# EAGLE design merch-hat (EAGLE 8.0.1)
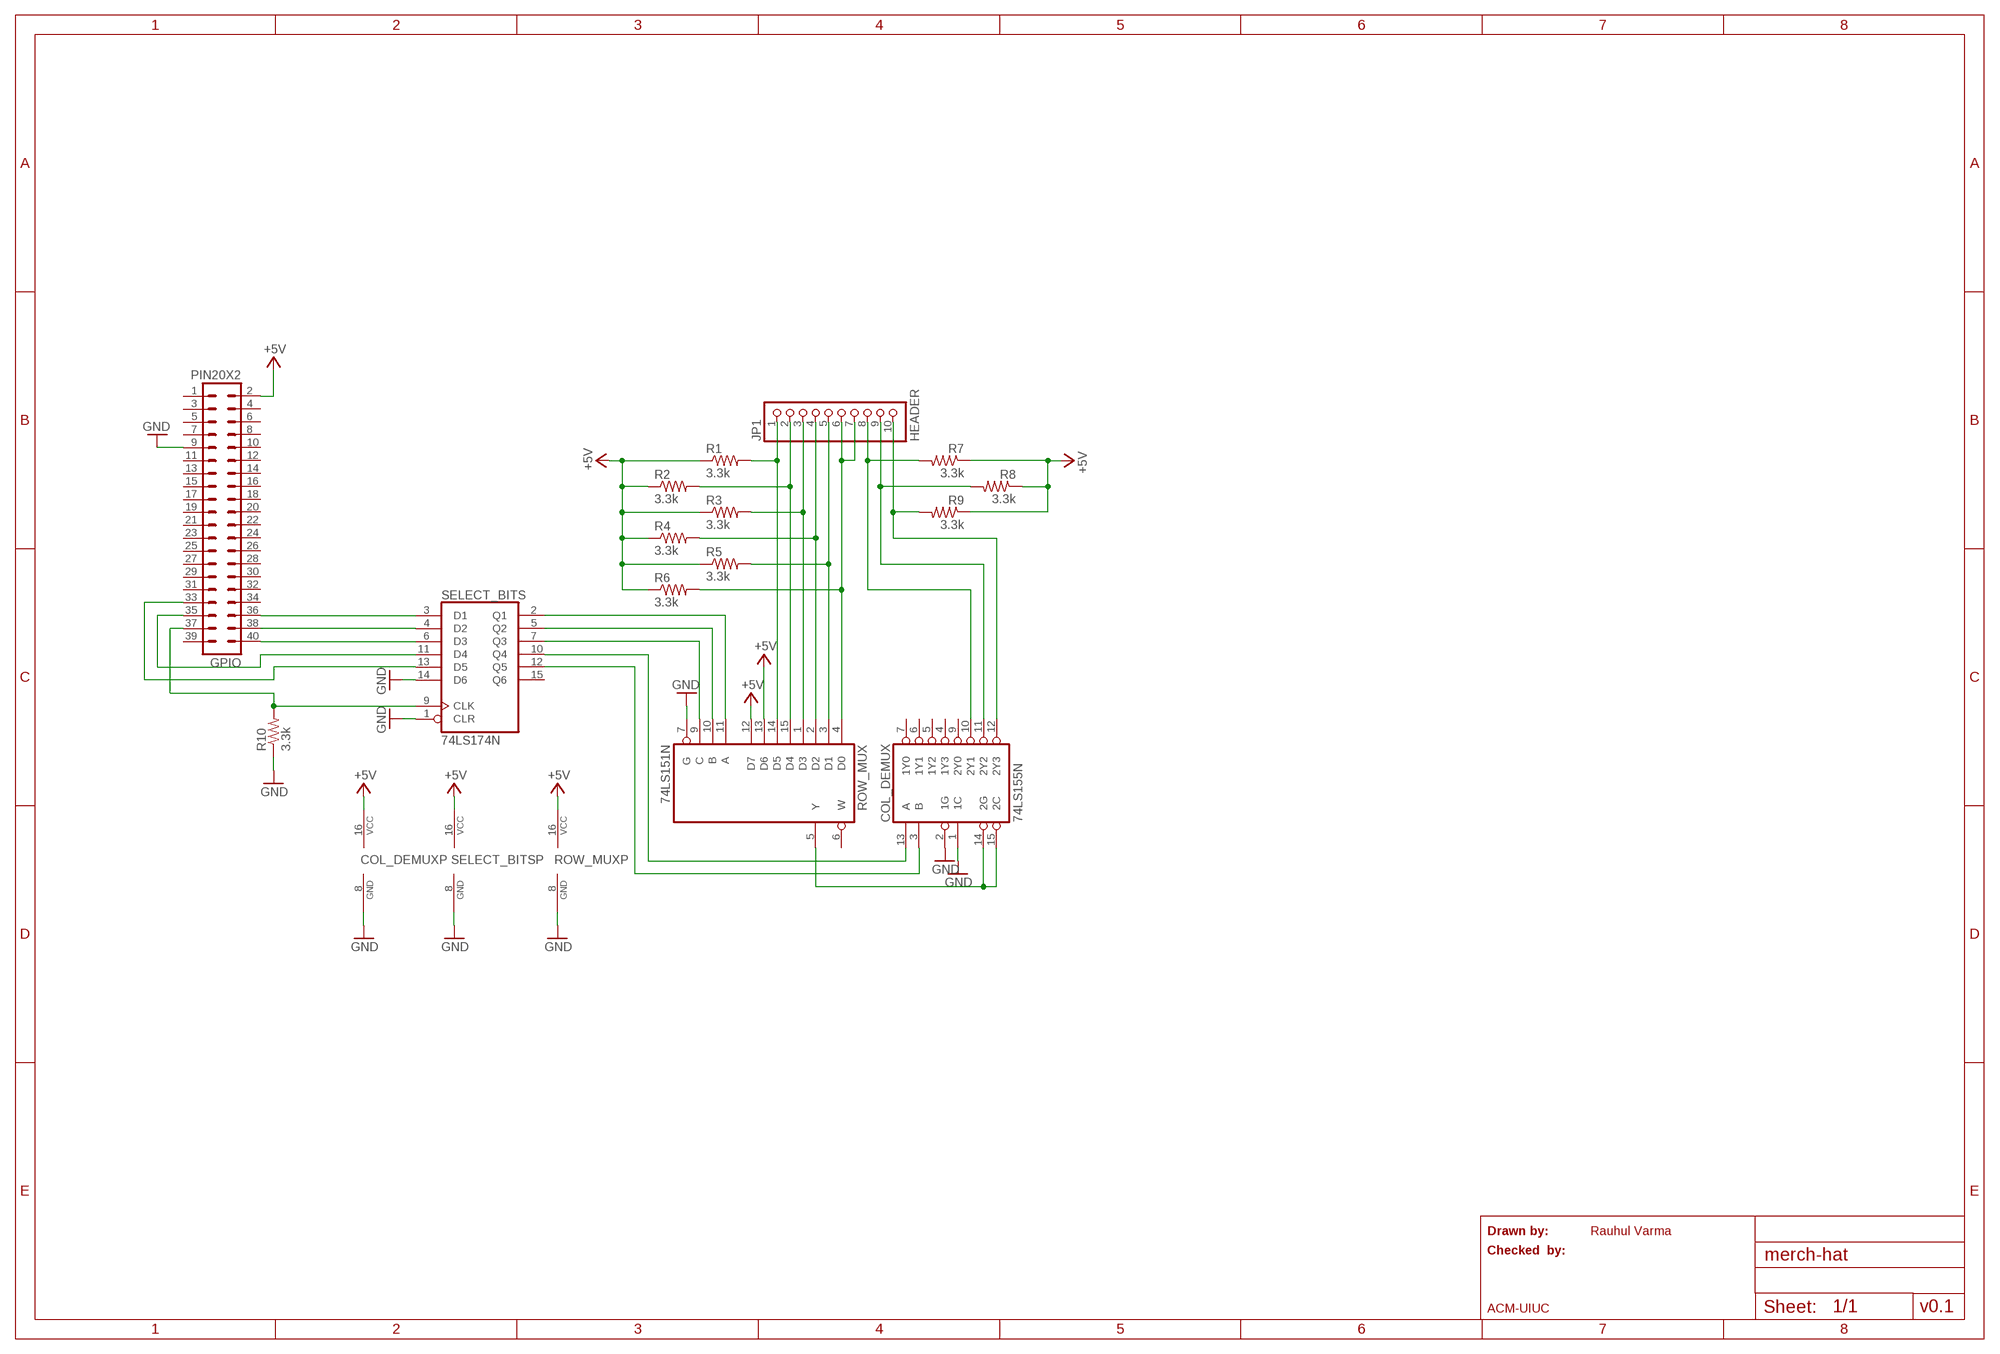
[diagram p0: schematic, sheet 1]

## Parts
COL_DEMUX  74LS155N  [DIL16]
GPIO  PIN20X2  [PIN_20X2]
JP1  HEADER  PINHD-1X10  [1X10]
R1  3.3k  R-US_0207/10  [0207/10]
R2  3.3k  R-US_0207/10  [0207/10]
R3  3.3k  R-US_0207/10  [0207/10]
R4  3.3k  R-US_0207/10  [0207/10]
R5  3.3k  R-US_0207/10  [0207/10]
R6  3.3k  R-US_0207/10  [0207/10]
R7  3.3k  R-US_0207/10  [0207/10]
R8  3.3k  R-US_0207/10  [0207/10]
R9  3.3k  R-US_0207/10  [0207/10]
R10  3.3k  R-US_0207/10  [0207/10]
ROW_MUX  74LS151N  [DIL16]
SELECT_BITS  74LS174N  [DIL16]

## Nets
+5V: COL_DEMUX.16(VCC) GPIO.2 R1.1 R2.1 R3.1 R4.1 R5.1 R6.1 R7.1 R8.1 R9.1 ROW_MUX.12(D7) ROW_MUX.13(D6) ROW_MUX.16(VCC) SELECT_BITS.16(VCC)
GND: COL_DEMUX.1(1C) COL_DEMUX.2(1G) COL_DEMUX.8(GND) GPIO.9 R10.1 ROW_MUX.7(G) ROW_MUX.8(GND) SELECT_BITS.1(CLR) SELECT_BITS.8(GND) SELECT_BITS.14(D6)
N$1: JP1.1 R1.2 ROW_MUX.14(D5)
N$2: GPIO.38 SELECT_BITS.4(D2)
N$3: GPIO.40 SELECT_BITS.6(D3)
N$4: JP1.2 R2.2 ROW_MUX.15(D4)
N$5: GPIO.35 SELECT_BITS.11(D4)
N$6: GPIO.36 SELECT_BITS.3(D1)
N$7: GPIO.33 SELECT_BITS.13(D5)
N$8: GPIO.37 R10.2 SELECT_BITS.9(CLK)
N$9: JP1.3 R3.2 ROW_MUX.1(D3)
N$10: JP1.4 R4.2 ROW_MUX.2(D2)
N$11: JP1.5 R5.2 ROW_MUX.3(D1)
N$12: ROW_MUX.11(A) SELECT_BITS.2(Q1)
N$13: JP1.6 JP1.7 R6.2 ROW_MUX.4(D0)
N$14: COL_DEMUX.10(2Y1) JP1.8 R7.2
N$15: COL_DEMUX.11(2Y2) JP1.9 R8.2
N$16: COL_DEMUX.12(2Y3) JP1.10 R9.2
N$17: ROW_MUX.10(B) SELECT_BITS.5(Q2)
N$18: ROW_MUX.9(C) SELECT_BITS.7(Q3)
N$20: COL_DEMUX.13(A) SELECT_BITS.10(Q4)
N$21: COL_DEMUX.3(B) SELECT_BITS.12(Q5)
N$22: COL_DEMUX.14(2G) COL_DEMUX.15(2C) ROW_MUX.5(Y)
Unconnected: COL_DEMUX.4(1Y3) COL_DEMUX.5(1Y2) COL_DEMUX.6(1Y1) COL_DEMUX.7(1Y0) COL_DEMUX.9(2Y0) GPIO.1 GPIO.3 GPIO.4 GPIO.5 GPIO.6 GPIO.7 GPIO.8 GPIO.10 GPIO.11 GPIO.12 GPIO.13 GPIO.14 GPIO.15 GPIO.16 GPIO.17 GPIO.18 GPIO.19 GPIO.20 GPIO.21 GPIO.22 GPIO.23 GPIO.24 GPIO.25 GPIO.26 GPIO.27 GPIO.28 GPIO.29 GPIO.30 GPIO.31 GPIO.32 GPIO.34 GPIO.39 ROW_MUX.6(W) SELECT_BITS.15(Q6)

## Notes on the sheet
- Drawn by: | Rauhul Varma
- Checked  by:
- ACM-UIUC | v0.1

## Library data of the parts
COL_DEMUX = 74xx-us:74*155: Dual 2-line to 4-line data DECODER/DEMULTIPLEXER
GPIO = FLYFISH:PIN20X2
JP1 = pinhead:PINHD-1X10: PIN HEADER
R1-R10 = resistor:R-US_: RESISTOR, American symbol
ROW_MUX = 74xx-us:74*151: Data SELECTOR/MULTIPLEXER
SELECT_BITS = 74xx-us:74*174: Hex D type FLIP FLOP, clear

## Board
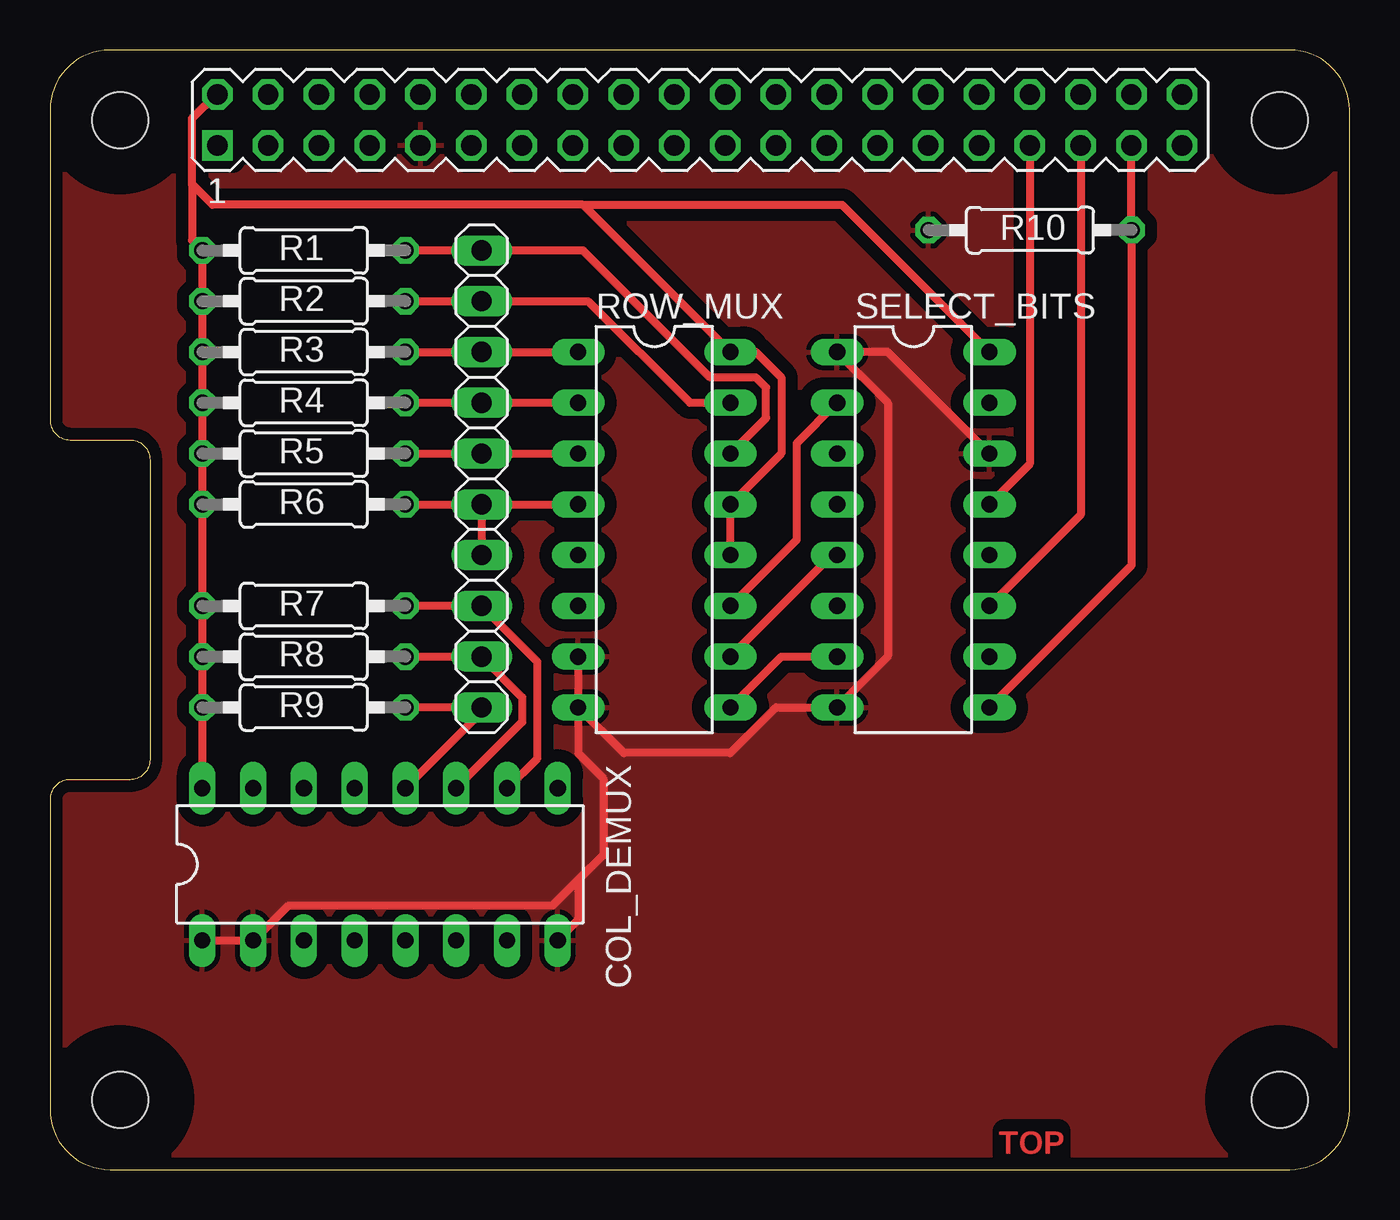
[diagram p1: board, top side]
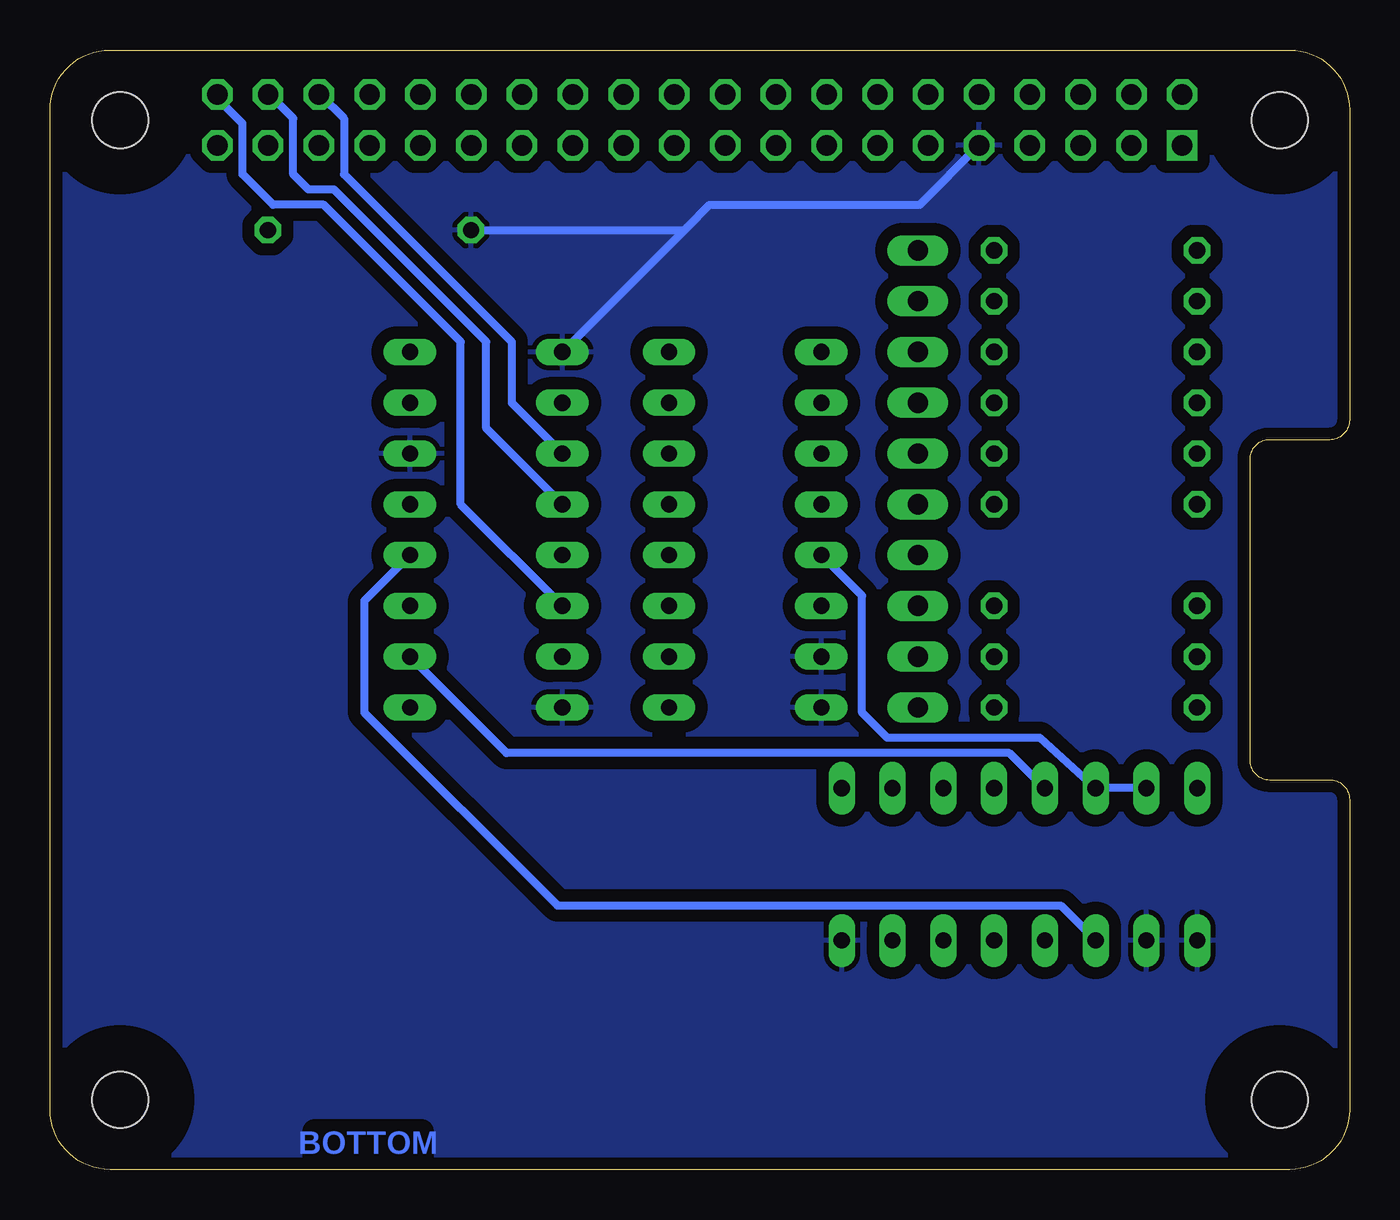
[diagram p2: board, bottom side, seen from below]

Size 65 x 56 mm. Coordinates in mm from the lower left corner, seen from the top.
Outline: 0,3 arc90 3,0 62,0 arc90 65,3 65,53 arc90 62,56 3,56 arc90 0,53 0,37.5 arc90 1,36.5 4,36.5 arc-90 5,35.5 5,20.5 arc-90 4,19.5 1,19.5 arc90 0,18.5 0,3
Copper layers (1*16): Top 0.035mm / dielectric 1.5mm / Bottom 0.035mm
Design rules "SeeedStudio_2layer_DRU_no_angle_20140221": minimum track width 6mil, minimum drill 12mil, track to track 6mil, track to pad 6mil, pad to pad 6mil, via to via 6mil, smd to smd 0mil, copper to edge 10mil, drill to drill 10mil, minimum pad ring 10mil, minimum via ring 6mil, stop-mask expansion 2mil, vias tented up to drill 100mil, thermal gap 10mil
Holes 2.8 mm at 3.5,3.5 3.5,52.5 61.5,52.5 61.5,3.5
tRestrict: area 1.9,51 to 5,54; area 60,51 to 63,54; area 60,1.9 to 63,5; area 1.9,1.9 to 5,5
bRestrict: area 1.9,1.9 to 5,5; area 1.9,51 to 5,54; area 60,1.9 to 63,5; area 60,51 to 63,54

### Footprints (pad centres in the part's own frame; a part is rotated, then mirrored left to right if it is on the bottom)
DIL16 = drill 0.813 long: 1 -8.89,-3.81; 2 -6.35,-3.81; 3 -3.81,-3.81; 4 -1.27,-3.81; 5 1.27,-3.81; 6 3.81,-3.81; 7 6.35,-3.81; 8 8.89,-3.81; 9 8.89,3.81; 10 6.35,3.81; 11 3.81,3.81; 12 1.27,3.81; 13 -1.27,3.81; 14 -3.81,3.81; 15 -6.35,3.81; 16 -8.89,3.81
PIN_20X2 = drill 1.016 square: 1 -24.13,-1.27 | drill 1.016 octagon: 2 -24.13,1.27; 3 -21.59,-1.27; 4 -21.59,1.27; 5 -19.05,-1.27; 6 -19.05,1.27; 7 -16.51,-1.27; 8 -16.51,1.27; 9 -13.97,-1.27; 10 -13.97,1.27; 11 -11.43,-1.27; 12 -11.43,1.27; 13 -8.89,-1.27; 14 -8.89,1.27; 15 -6.35,-1.27; 16 -6.35,1.27; 17 -3.81,-1.27; 18 -3.81,1.27; 19 -1.27,-1.27; 20 -1.27,1.27; 21 1.27,-1.27; 22 1.27,1.27; 23 3.81,-1.27; 24 3.81,1.27; 25 6.35,-1.27; 26 6.35,1.27; 27 8.89,-1.27; 28 8.89,1.27; 29 11.43,-1.27; 30 11.43,1.27; 31 13.97,-1.27; 32 13.97,1.27; 33 16.51,-1.27; 34 16.51,1.27; 35 19.05,-1.27; 36 19.05,1.27; 37 21.59,-1.27; 38 21.59,1.27; 39 24.13,-1.27; 40 24.13,1.27
1X10 = drill 1.016 long: 1 -11.43,0; 2 -8.89,0; 3 -6.35,0; 4 -3.81,0; 5 -1.27,0; 6 1.27,0; 7 3.81,0; 8 6.35,0; 9 8.89,0; 10 11.43,0
0207/10 = drill 0.813 octagon: 1 -5.08,0; 2 5.08,0

### Placement (x,y rotation side)
COL_DEMUX  16.51,15.27 0 top
GPIO  32.5,52.5 0 top
JP1  21.59,34.54 270 top
R1  12.7,45.97 0 top
R2  12.7,43.43 0 top
R3  12.7,40.89 0 top
R4  12.7,38.35 0 top
R5  12.7,35.81 0 top
R6  12.7,33.27 0 top
R7  12.7,28.19 0 top
R8  12.7,25.65 0 top
R9  12.7,23.11 0 top
R10  49.02,46.99 0 top
ROW_MUX  30.23,32 270 top
SELECT_BITS  43.18,32 270 top

### Tracks (layer width: path | path; a pad name or v marks a point on that pad's centre or on a via)
+5V
  Top 0.406: GPIO.2 8.3,53.77 7.11,52.58 7.11,49.28 | 7.11,49.28 7.11,46.48 R1.1 R2.1 R3.1 R4.1 R5.1 R6.1 R7.1 R8.1 R9.1 COL_DEMUX.16 | ROW_MUX.12 ROW_MUX.13 36.58,35.81 36.58,39.62 35.31,40.89 ROW_MUX.16 26.67,48.26 | 26.67,48.26 8.13,48.26 7.11,49.28 | 26.67,48.26 39.62,48.26 SELECT_BITS.16
GND
  Top 0.406: 26.42,14.48 26.42,12.48 COL_DEMUX.8 | ROW_MUX.7 ROW_MUX.8 | COL_DEMUX.1 COL_DEMUX.2 10.19,11.46 11.94,13.21 25.15,13.21 26.42,14.48 | SELECT_BITS.14 41.91,40.89 SELECT_BITS.1 41.91,38.35 41.91,25.65 SELECT_BITS.8 36.32,23.11 34.04,20.83 28.7,20.83 ROW_MUX.8 | ROW_MUX.8 26.42,20.83 27.69,19.56 27.69,15.75 26.42,14.48
  Bottom 0.406: 33.27,46.99 SELECT_BITS.1 | GPIO.9 21.5,48.26 32,48.26 33.15,47.12 33.27,46.99 | R10.1 33.27,46.99
  pour Bottom (isolate 0.61): 0,3 arc90 3,0 62,0 arc90 65,3 65,53 arc90 62,56 3,56 arc90 0,53 0,37.5 arc90 1,36.5 4,36.5 arc-90 5,35.5 5,20.5 arc-90 4,19.5 1,19.5 arc90 0,18.5
  pour Top (isolate 0.61): 0,3 arc90 3,0 62,0 arc90 65,3 65,53 arc90 62,56 3,56 arc90 0,53 0,37.5 arc90 1,36.5 4,36.5 arc-90 5,35.5 5,20.5 arc-90 4,19.5 1,19.5 arc90 0,18.5
N$1
  Top 0.406: R1.2 JP1.1 26.67,45.97 33.02,39.62 35.31,39.62 35.81,39.12 35.81,37.59 ROW_MUX.14
N$2
  Bottom 0.406: SELECT_BITS.4 43.18,37.08 43.18,41.4 50.8,49.02 52.07,49.02 52.83,49.78 52.83,52.58 54.02,53.77 GPIO.38
N$3
  Bottom 0.406: SELECT_BITS.6 44.45,33.27 44.45,41.4 51.31,48.26 53.85,48.26 55.37,49.78 55.37,52.32 56.63,53.58 GPIO.40
N$4
  Top 0.406: R2.2 JP1.2 26.92,43.43 32,38.35 ROW_MUX.15
N$5
  Top 0.406: GPIO.35 51.55,32.75 SELECT_BITS.11
N$6
  Bottom 0.406: SELECT_BITS.3 41.91,38.35 41.91,41.4 50.29,49.78 50.29,52.58 51.48,53.77 GPIO.36
N$7
  Top 0.406: GPIO.33 49.01,35.29 SELECT_BITS.13
N$8
  Top 0.406: 54.09,46.74 GPIO.37 | 54.09,46.74 54.09,30.21 SELECT_BITS.9 | R10.2 54.1,46.75 54.09,46.74
N$9
  Top 0.406: R3.2 JP1.3 ROW_MUX.1
N$10
  Top 0.406: R4.2 JP1.4 ROW_MUX.2
N$11
  Top 0.406: R5.2 JP1.5 ROW_MUX.3
N$12
  Top 0.406: SELECT_BITS.2 37.34,36.32 37.34,31.5 ROW_MUX.11
N$13
  Top 0.406: R6.2 JP1.6 | JP1.6 JP1.7 | JP1.6 ROW_MUX.4
N$14
  Top 0.406: R7.2 JP1.8 24.38,25.4 24.38,20.57 22.89,19.08 COL_DEMUX.10
N$15
  Top 0.406: R8.2 JP1.9 23.62,23.62 23.62,22.38 COL_DEMUX.11
N$16
  Top 0.406: R9.2 JP1.10 21.59,22.89 COL_DEMUX.12
N$17
  Top 0.406: SELECT_BITS.5 39.12,30.73 ROW_MUX.10
N$18
  Top 0.406: ROW_MUX.9 36.58,25.65 SELECT_BITS.7
N$20
  Bottom 0.406: COL_DEMUX.13 15.27,19.08 17.02,20.83 42.16,20.83 SELECT_BITS.10
N$21
  Bottom 0.406: SELECT_BITS.12 49.28,28.45 49.28,22.86 39.62,13.21 14.45,13.21 COL_DEMUX.3
N$22
  Bottom 0.406: COL_DEMUX.15 COL_DEMUX.14 12.73,19.08 15.49,21.59 23.11,21.59 24.38,22.86 24.38,28.7 ROW_MUX.5

### Text on the board
Top: TOP
Bottom: BOTTOM